# Altium schematic sheet dat.SchDoc
size B
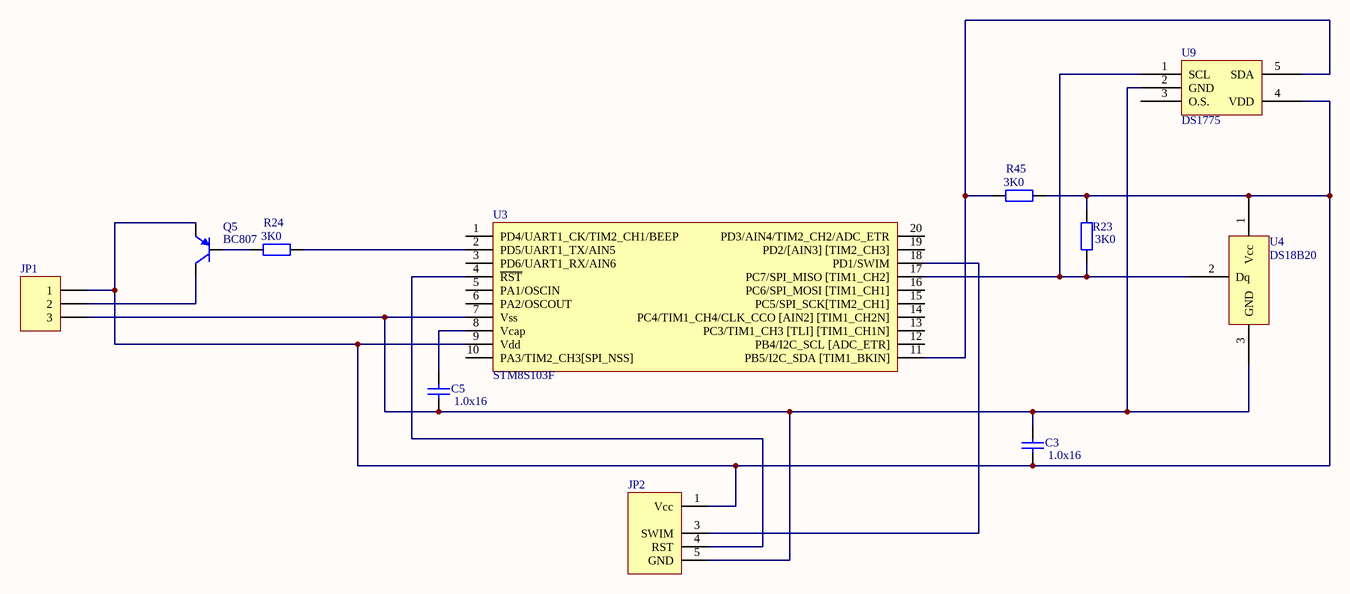
[diagram p0: dat.SchDoc]

## Parts
C3  1.0x16  [_1206]
C5  1.0x16  [_1206]
JP1  DG306-5.0-03P  [BT5-3]  (value not drawn)
JP2  (no value)  [HDR1X5_uart]
Q5  BC807  [SO-G3]
R23  3K0  [_1206]
R24  3K0  [_1206]
R45  3K0  [_1206]
U3  (no value)  [TSSO6x6-G20/Y1.6]
U4  DS18B20  [DS18B20_H]
U9  DS1775  [SO-G5/P.95]

## Nets
NetC3_1: C3.1 JP1.1 JP2.1(Vcc) Q5.2(E) R23.1 R45.2 U3.9(Vdd) U4.1(Vcc) U9.4(VDD)
NetC3_2: C3.2 C5.1 JP1.3 JP2.5(GND) U3.7(Vss) U4.3(GND) U9.2(GND)
NetC5_2: C5.2 U3.8(Vcap)
NetJP1_2: JP1.2 Q5.3(C)
NetJP2_3: JP2.3(SWIM) U3.18(PD1/SWIM)
NetJP2_4: JP2.4(RST) U3.4(~{RST})
NetQ5_1: Q5.1(B) R24.2
NetR23_2: R23.2 U3.17(PC7/SPI_MISO_[TIM1_CH2]) U4.2(Dq) U9.1(SCL)
NetR24_1: R24.1 U3.2(PD5/UART1_TX/AIN5)
NetR45_1: R45.1 U3.11(PB5/I2C_SDA_[TIM1_BKIN]) U9.5(SDA)

Not connected (* = marked no-connect by the designer): U3 1(PD4/UART1_CK/TIM2_CH1/BEEP) 3(PD6/UART1_RX/AIN6) 5(PA1/OSCIN) 6(PA2/OSCOUT) 10(PA3/TIM2_CH3[SPI_NSS]) 12(PB4/I2C_SCL_[ADC_ETR]) 13(PC3/TIM1_CH3_[TLI]_[TIM1_CH1N]) 14(PC4/TIM1_CH4/CLK_CCO_[AIN2]_[TIM1_CH2N]) 15(PC5/SPI_SCK[TIM2_CH1]) 16(PC6/SPI_MOSI_[TIM1_CH1]) 19(PD2/[AIN3]_[TIM2_CH3]) 20(PD3/AIN4/TIM2_CH2/ADC_ETR); U9 3(O.S.)

## Library data of the parts
C3 C5 = Cap Semi: Capacitor; Manufacturer: Generic Components; Class I: Passive; Value: 0,1; Published: 8-Jun-2000; Revision: July-2002: Re-released for DXP Platform.; Publisher: Altium Limited; Class II: Capacitor
JP1 = Header 3: Header, 3-Pin; Manufacturer: Generic Components; Class I: Connector; Revision: July-2002: Re-released for DXP Platform.; Publisher: Altium Limited
JP2 = SWIM_CONN
Q5 = BC857ALT1: General Purpose Transistor PNP Silicon; Manufacturer: Motorola; Package Information: Latest Revision: 1997; Class I: Discrete; Class II: BJT - Low Power; Published: 29-Sep-2000; Revision: July-2002: Re-released for DXP Platform.; Datasheet: Latest Revision: 1997; Package Reference: 318-08; Publisher: Altium Limited
R23 R24 R45 = Res2: Resistor; Manufacturer: Generic Components; Class I: Passive; Value: 1K0; Published: 8-Jun-2000; Revision: July-2002: Re-released for DXP Platform.; Publisher: Altium Limited; Class II: Resistor
U3 = STM8S103F